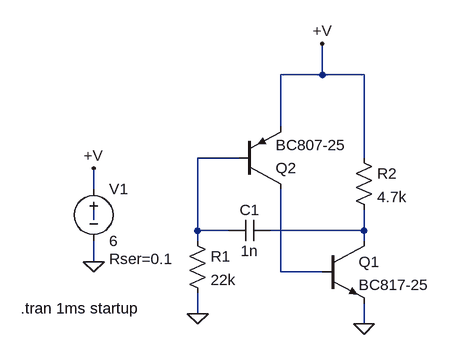
[diagram p0: schematic oscilator-2.asc]
oscilator-2.asc, the LTspice schematic file:
Version 4
SHEET 1 880 680
WIRE 160 -176 160 -224
WIRE 160 -176 96 -176
WIRE 224 -176 160 -176
WIRE 96 -96 96 -176
WIRE 32 -48 -32 -48
WIRE 224 -48 224 -176
WIRE -192 0 -192 -32
WIRE -192 48 -192 32
WIRE -32 64 -32 -48
WIRE 16 64 -32 64
WIRE 224 64 224 32
WIRE 224 64 80 64
WIRE -32 80 -32 64
WIRE 224 80 224 64
WIRE -192 112 -192 80
WIRE 96 128 96 0
WIRE 160 128 96 128
WIRE -32 192 -32 160
WIRE 224 208 224 176
FLAG 224 208 0
FLAG -32 192 0
FLAG -192 112 0
FLAG -192 -32 +V
FLAG 160 -224 +V
SYMBOL npn 160 80 R0
SYMATTR InstName Q1
SYMATTR Value BC817-25
SYMBOL pnp 32 0 M180
SYMATTR InstName Q2
SYMATTR Value BC807-25
SYMBOL res -48 64 R0
SYMATTR InstName R1
SYMATTR Value 22k
SYMBOL cap 80 48 R90
WINDOW 0 0 32 VBottom 2
WINDOW 3 32 32 VTop 2
SYMATTR InstName C1
SYMATTR Value 1n
SYMBOL res 208 -64 R0
SYMATTR InstName R2
SYMATTR Value 4.7k
SYMBOL voltage -192 -16 R0
WINDOW 123 0 0 Left 2
WINDOW 39 24 124 Left 2
SYMATTR SpiceLine Rser=0.1
SYMATTR InstName V1
SYMATTR Value 6
TEXT -304 184 Left 2 !.tran 1ms startup

The netlist it stands for:
* oscilator-2.asc
Q1 N003 N004 0 0 BC817-25
Q2 N004 N001 +V 0 BC807-25
R1 N001 0 22k
C1 N003 N001 1n
R2 +V N003 4.7k
V1 +V 0 6 Rser=0.1
.model NPN NPN
.model PNP PNP
.lib standard.bjt
.tran 1ms startup
.backanno
.end